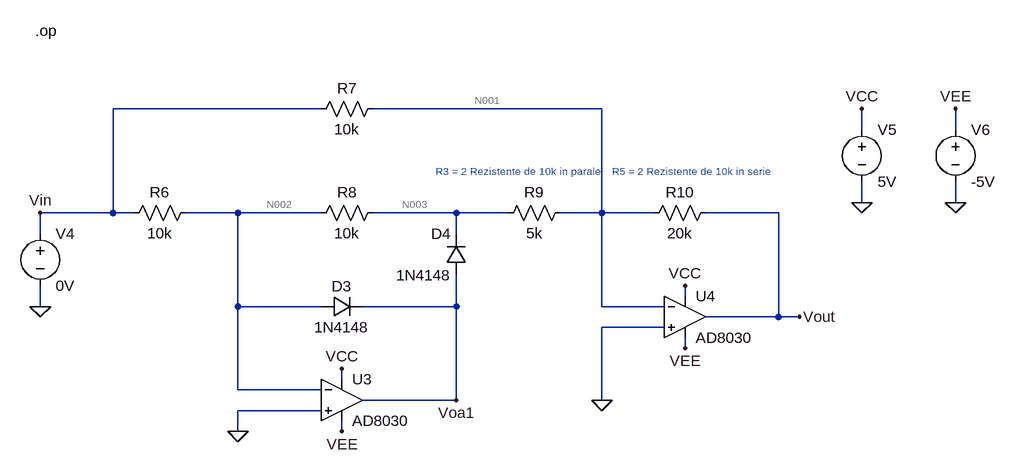
[diagram p0: schematic Etaj 4 - Dcop psf.asc]
Etaj 4 - Dcop psf.asc, the LTspice schematic file:
Version 4.1
SHEET 1 1540 1192
WIRE 496 -128 176 -128
WIRE 928 -128 576 -128
WIRE 1328 -96 1328 -128
WIRE 1472 -96 1472 -128
WIRE 1328 16 1328 -16
WIRE 1472 16 1472 -16
WIRE 176 32 176 -128
WIRE 176 32 64 32
WIRE 208 32 176 32
WIRE 368 32 288 32
WIRE 496 32 368 32
WIRE 704 32 576 32
WIRE 784 32 704 32
WIRE 928 32 928 -128
WIRE 928 32 864 32
WIRE 1008 32 928 32
WIRE 1200 32 1088 32
WIRE 64 64 64 32
WIRE 704 64 704 32
WIRE 1056 160 1056 144
WIRE 64 176 64 144
WIRE 368 176 368 32
WIRE 496 176 368 176
WIRE 704 176 704 128
WIRE 704 176 560 176
WIRE 928 176 928 32
WIRE 1024 176 928 176
WIRE 1200 192 1200 32
WIRE 1200 192 1088 192
WIRE 1232 192 1200 192
WIRE 1024 208 928 208
WIRE 1056 240 1056 224
WIRE 528 288 528 272
WIRE 368 304 368 176
WIRE 496 304 368 304
WIRE 704 320 704 176
WIRE 704 320 560 320
WIRE 928 320 928 208
WIRE 496 336 368 336
WIRE 368 368 368 336
WIRE 528 368 528 352
FLAG 368 368 0
FLAG 64 176 0
FLAG 928 320 0
FLAG 1328 16 0
FLAG 1472 16 0
FLAG 1328 -128 VCC
FLAG 1472 -128 VEE
FLAG 1056 144 VCC
FLAG 528 272 VCC
FLAG 1056 240 VEE
FLAG 528 368 VEE
FLAG 1232 192 Vout
FLAG 64 32 Vin
FLAG 704 320 Voa1
DATAFLAG 1200 192 ""
DATAFLAG 1200 192 ""
SYMBOL voltage 64 48 R0
WINDOW 123 0 0 Left 0
WINDOW 39 0 0 Left 0
SYMATTR InstName V4
SYMATTR Value 0V
SYMBOL res 304 16 R90
WINDOW 0 0 56 VBottom 2
WINDOW 3 32 56 VTop 2
SYMATTR InstName R6
SYMATTR Value 10k
SYMBOL res 592 -144 R90
WINDOW 0 0 56 VBottom 2
WINDOW 3 32 56 VTop 2
SYMATTR InstName R7
SYMATTR Value 10k
SYMBOL res 592 16 R90
WINDOW 0 0 56 VBottom 2
WINDOW 3 32 56 VTop 2
SYMATTR InstName R8
SYMATTR Value 10k
SYMBOL diode 496 192 R270
WINDOW 0 32 32 VTop 2
WINDOW 3 0 32 VBottom 2
SYMATTR InstName D3
SYMATTR Value 1N4148
SYMBOL diode 720 128 R180
WINDOW 0 24 64 Left 2
WINDOW 3 24 0 Left 2
SYMATTR InstName D4
SYMATTR Value 1N4148
SYMBOL res 880 16 R90
WINDOW 0 0 56 VBottom 2
WINDOW 3 32 56 VTop 2
SYMATTR InstName R9
SYMATTR Value 5k
SYMBOL OpAmps\\AD8030 528 256 R0
SYMATTR InstName U3
SYMBOL res 1104 16 R90
WINDOW 0 0 56 VBottom 2
WINDOW 3 32 56 VTop 2
SYMATTR InstName R10
SYMATTR Value 20k
SYMBOL OpAmps\\AD8030 1056 128 R0
SYMATTR InstName U4
SYMBOL voltage 1328 -112 R0
WINDOW 123 0 0 Left 0
WINDOW 39 0 0 Left 0
SYMATTR InstName V5
SYMATTR Value 5V
SYMBOL voltage 1472 -112 R0
WINDOW 123 0 0 Left 0
WINDOW 39 0 0 Left 0
SYMATTR InstName V6
SYMATTR Value -5V
TEXT 56 -248 Left 2 !.op
TEXT 944 -32 Left 1 ;R5 = 2 Rezistente de 10k in serie
TEXT 672 -32 Left 1 ;R3 = 2 Rezistente de 10k in paralel

The netlist it stands for:
* Etaj 4 - Dcop psf.asc
V4 Vin 0 0V
R6 N002 Vin 10k
R7 N001 Vin 10k
R8 N003 N002 10k
D3 N002 Voa1 1N4148
D4 Voa1 N003 1N4148
R9 N001 N003 5k
X§U3 0 N002 VCC VEE Voa1 AD8040  ; AD8030, pins In+ In- V+ V- OUT
R10 Vout N001 20k
X§U4 0 N001 VCC VEE Vout AD8040  ; AD8030, pins In+ In- V+ V- OUT
V5 VCC 0 5V
V6 VEE 0 -5V
.model D D
.lib standard.dio
.op
* R5 = 2 Rezistente de 10k in serie
* R3 = 2 Rezistente de 10k in paralel
.lib ADI.lib
.backanno
.end

* Results of the author's LTspice run, read from the files saved beside the schematic
* Operating Point:
*   V(n001) = 465.9 nV
*   V(n002) = 1.486 µV
*   V(n003) = -7.583 µV
*   V(vcc) = 5 V
*   V(vee) = -5 V
*   V(vin) = 0 V
*   V(voa1) = -295.2 mV
*   V(vout) = -33.97 mV
*   I(D3) = 1.699 µA
*   I(D4) = -2.517 nA
*   I(R10) = -1.698 µA
*   I(R6) = 148.6 pA
*   I(R7) = 46.59 pA
*   I(R8) = -906.9 pA
*   I(R9) = 1.61 nA
*   I(V4) = 195.2 pA
*   I(V5) = -2.612 mA
*   I(V6) = 2.608 mA
*   Ix(u3:1) = -1.7 µA
*   Ix(u3:2) = -1.7 µA
*   Ix(u3:3) = 1.307 mA
*   Ix(u3:4) = -1.305 mA
*   Ix(u3:5) = 1.701 µA
*   Ix(u4:1) = -1.7 µA
*   Ix(u4:2) = -1.7 µA
*   Ix(u4:3) = 1.305 mA
*   Ix(u4:4) = -1.303 mA
*   Ix(u4:5) = 1.698 µA